# Altium project MK3 Watch Board.PrjPcb
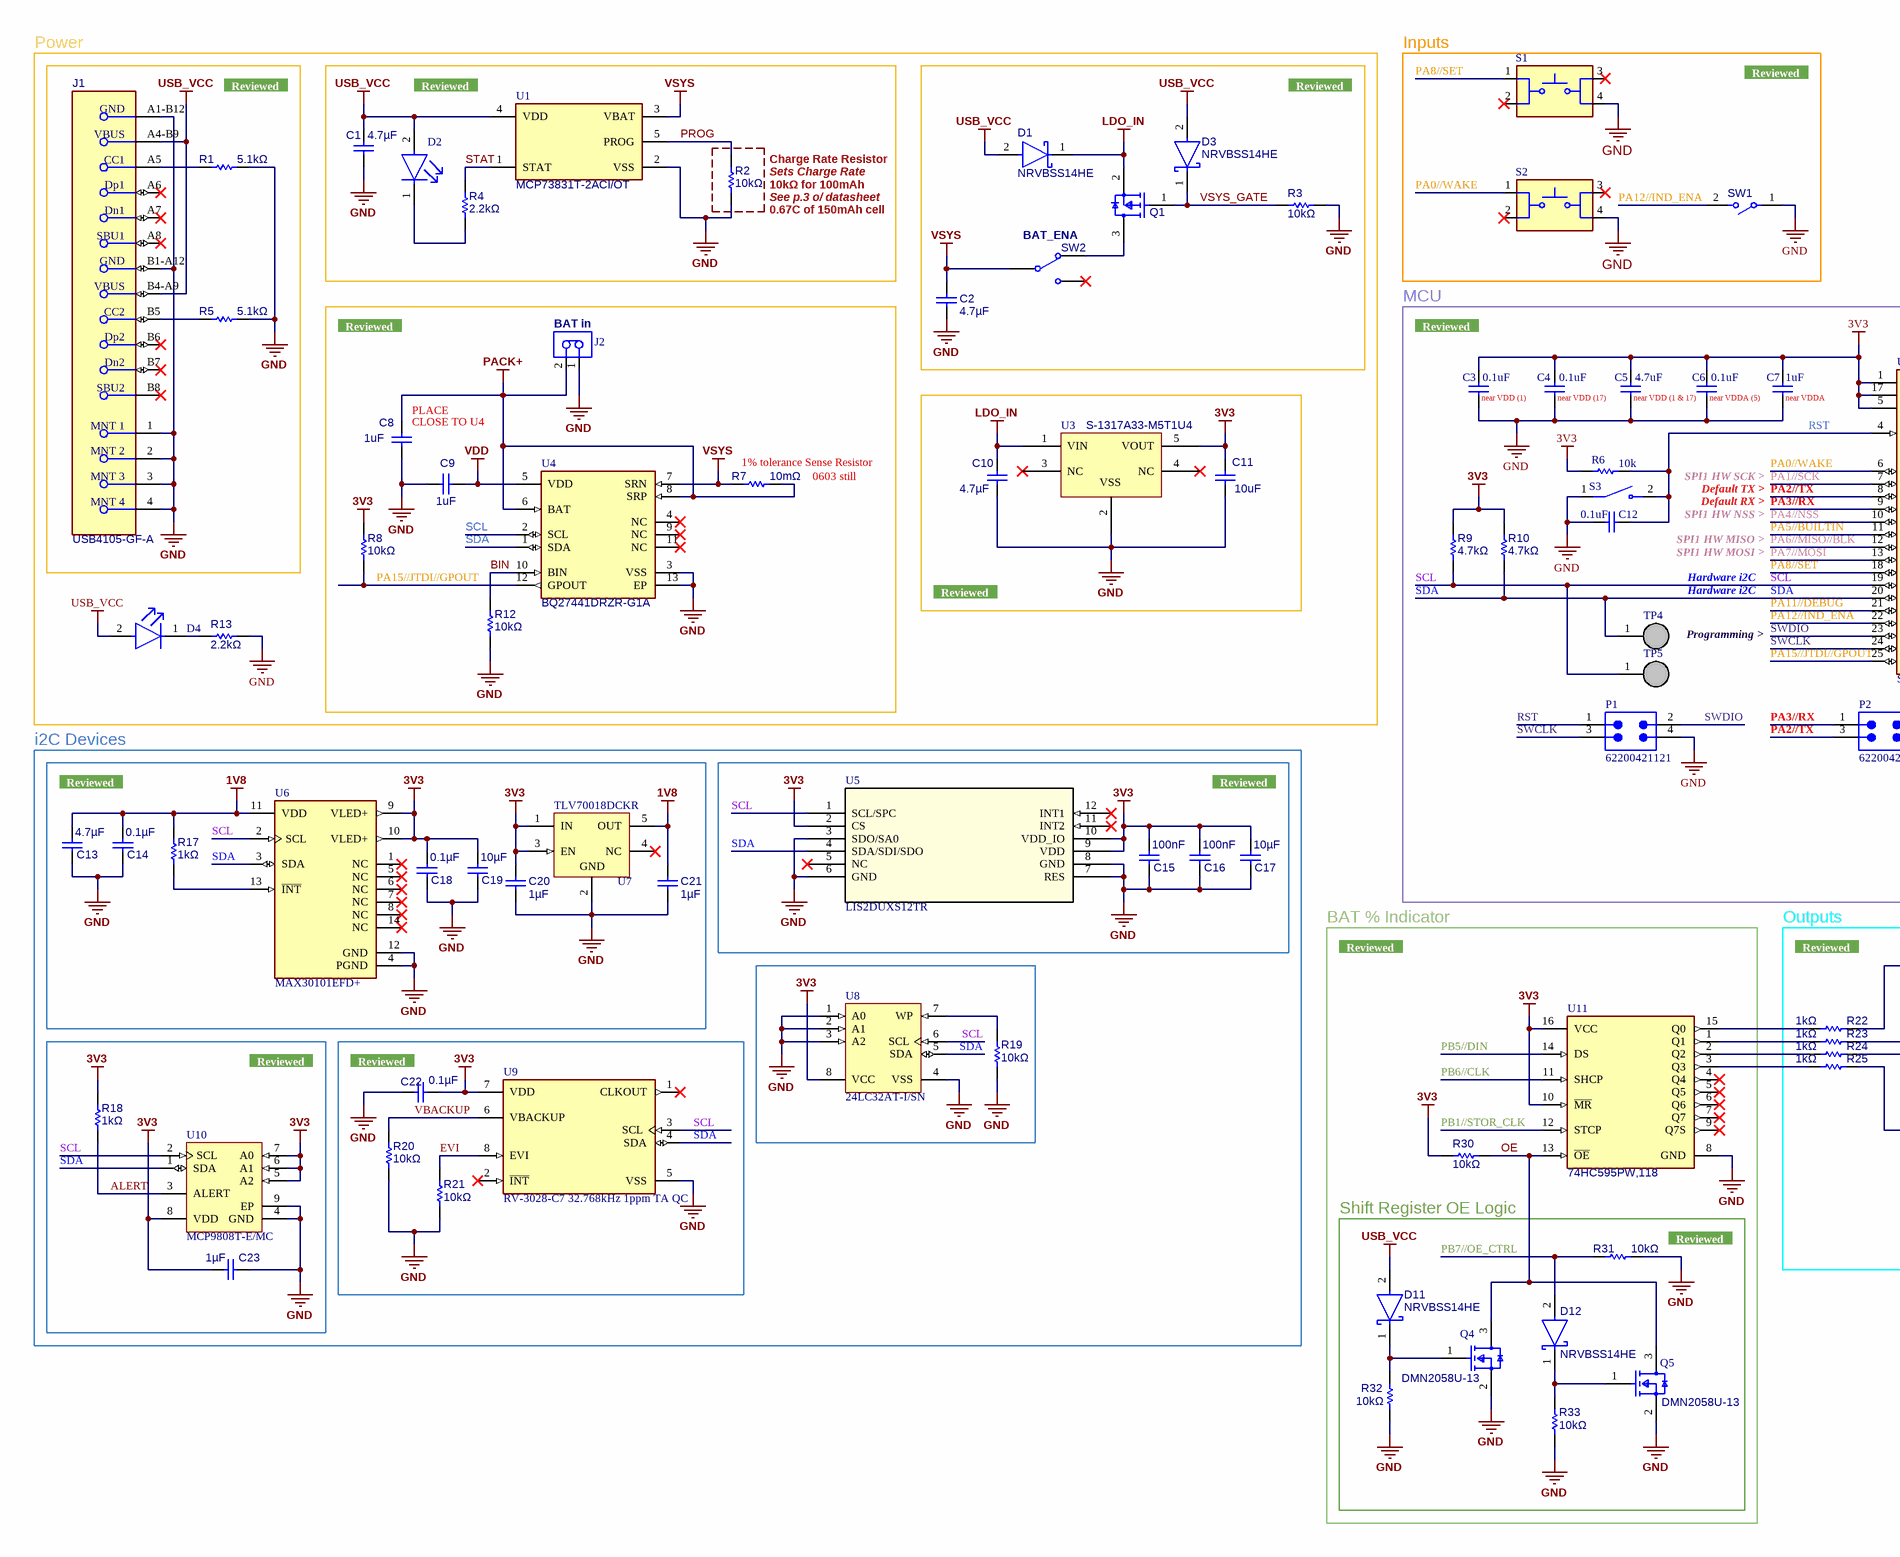
[diagram p0: Main.SchDoc, left]
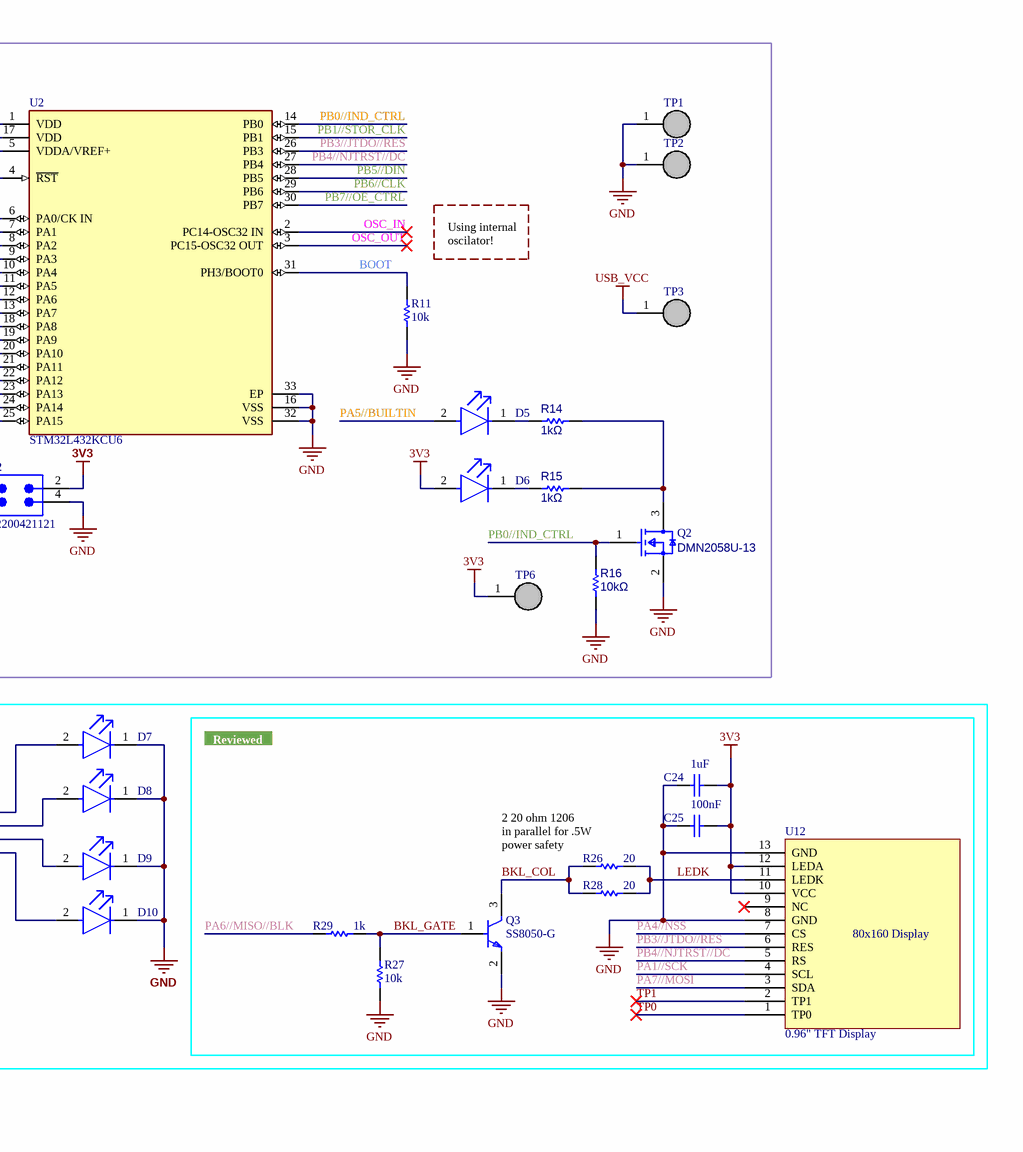
[diagram p1: Main.SchDoc, right]
1 sheet, 102 parts. Net scope: global (net labels, ports and power ports of the same name join across sheets).
Board file: Main.PcbDoc

## Sheet Main.SchDoc
size 1524 x 1524 mm; SheetNumber: 1; SheetTotal: 1

### Parts
C1  4.7µF  [WCAP-CSGP_0603_L1.6W0.8H0.8_Reflow]
C2  4.7µF  [WCAP-CSGP_0603_L1.6W0.8H0.8_Reflow]
C3  0.1uF  [CAPC1608X87X35NL15T15]
C4  0.1uF  [CAPC1608X87X35NL15T15]
C5  4.7uF  [CAPC1608X87X35NL15T15]
C6  0.1uF  [CAPC1608X87X35NL15T15]
C7  1uF  [CAPC1608X87X35NL15T15]
C8  1uF  [WCAP-CSGP_0603_L1.6W0.8H0.8_Reflow]
C9  1uF  [WCAP-CSGP_0603_L1.6W0.8H0.8_Reflow]
C10  4.7µF  [WCAP-CSGP_0603_L1.6W0.8H0.8_Reflow]
C11  10uF  [WCAP-CSGP_0603_L1.6W0.8H0.8_Reflow]
C12  0.1uF  [CAPC1608X87X35NL15T15]
C13  4.7µF  [WCAP-CSGP_0603_L1.6W0.8H0.8_Reflow]
C14  0.1µF  [WCAP-CSGP_0603_L1.6W0.8H0.8_Reflow]
C15  100nF  [WCAP-CSGP_0603_L1.6W0.8H0.8_Reflow]
C16  100nF  [WCAP-CSGP_0603_L1.6W0.8H0.8_Reflow]
C17  10µF  [WCAP-CSGP_0603_L1.6W0.8H0.8_Reflow]
C18  0.1µF  [WCAP-CSGP_0603_L1.6W0.8H0.8_Reflow]
C19  10µF  [WCAP-CSGP_0603_L1.6W0.8H0.8_Reflow]
C20  1µF  [WCAP-CSGP_0603_L1.6W0.8H0.8_Reflow]
C21  1µF  [WCAP-CSGP_0603_L1.6W0.8H0.8_Reflow]
C22  0.1µF  [WCAP-CSGP_0603_L1.6W0.8H0.8_Reflow]
C23  1µF  [WCAP-CSGP_0603_L1.6W0.8H0.8_Reflow]
C24  1uF  [CAPC1608X87X35NL15T15]
C25  100nF  [CAPC1608X87X35NL15T15]
D1  NRVBSS14HE  [FP-477AD-MFG]
D2  LTST-C190KGKT  [FP-LTST-C190KGKT-MFG]  (value not drawn)
D3  NRVBSS14HE  [FP-477AD-MFG]
D4  LTST-C190KGKT  [FP-LTST-C190KGKT-MFG]  (value not drawn)
D5  LTST-C190KGKT  [FP-LTST-C190KGKT-MFG]  (value not drawn)
D6  LTST-C190KGKT  [FP-LTST-C190KGKT-MFG]  (value not drawn)
D7  LTST-C190KGKT  [FP-LTST-C190KGKT-MFG]  (value not drawn)
D8  LTST-C190KGKT  [FP-LTST-C190KGKT-MFG]  (value not drawn)
D9  LTST-C190KGKT  [FP-LTST-C190KGKT-MFG]  (value not drawn)
D10  LTST-C190KGKT  [FP-LTST-C190KGKT-MFG]  (value not drawn)
D11  NRVBSS14HE  [FP-477AD-MFG]
D12  NRVBSS14HE  [FP-477AD-MFG]
J1  USB4105-GF-A  [FP-USB4105-GF-A-MFG]
J2  B2B-PH-K-S(LF)(SN)  [JST-B2B-PH-K-S_V]  (value not drawn)
P1  62200421121  [62200421121]
P2  62200421121  [62200421121]
Q1  IRLML6402TRPBF  [FP-Micro3-MFG]  (value not drawn)
Q2  DMN2058U-13  [FP-C04-17458-MFG]
Q3  SS8050-G  [FP-SS8050-G-MFG]
Q4  DMN2058U-13  [FP-C04-17458-MFG]
Q5  DMN2058U-13  [FP-C04-17458-MFG]
R1  5.1kΩ  [RESC1608X55X25NL10T15]
R2  10kΩ  [RESC1608X55X25NL10T15]
R3  10kΩ  [RESC1608X55X25NL10T15]
R4  2.2kΩ  [RESC1608X55X25NL10T15]
R5  5.1kΩ  [RESC1608X55X25NL10T15]
R6  10k  [RESC1608X55X25NL10T15]
R7  10mΩ  [RESC1608X55X25NL10T15]
R8  10kΩ  [RESC1608X55X25NL10T15]
R9  4.7kΩ  [RESC1608X55X25NL10T15]
R10  4.7kΩ  [RESC1608X55X25NL10T15]
R11  10k  [RESC1608X55X25NL10T15]
R12  10kΩ  [RESC1608X55X25NL10T15]
R13  2.2kΩ  [RESC1608X55X25NL10T15]
R14  1kΩ  [RESC1608X55X25NL10T15]
R15  1kΩ  [RESC1608X55X25NL10T15]
R16  10kΩ  [RESC1608X55X25NL10T15]
R17  1kΩ  [RESC1608X55X25NL10T15]
R18  1kΩ  [RESC1608X55X25NL10T15]
R19  10kΩ  [RESC1608X55X25NL10T15]
R20  10kΩ  [RESC1608X55X25NL10T15]
R21  10kΩ  [RESC1608X55X25NL10T15]
R22  1kΩ  [RESC1608X55X25NL10T15]
R23  1kΩ  [RESC1608X55X25NL10T15]
R24  1kΩ  [RESC1608X55X25NL10T15]
R25  1kΩ  [RESC1608X55X25NL10T15]
R26  20  [RESC3116X65X40NL10T20]
R27  10k  [RESC1608X55X25NL10T15]
R28  20  [RESC3116X65X40NL10T20]
R29  1k  [RESC1608X55X25NL10T15]
R30  10kΩ  [RESC1608X55X25NL10T15]
R31  10kΩ  [RESC1608X55X25NL10T15]
R32  10kΩ  [RESC1608X55X25NL10T15]
R33  10kΩ  [RESC1608X55X25NL10T15]
S1  SWT0325-073016TSK_REVA  [SW_SWT0325-073016TSK_REVA]  (value not drawn)
S2  SWT0325-073016TSK_REVA  [SW_SWT0325-073016TSK_REVA]  (value not drawn)
S3  TS09-63-25-WT-260-SMT-TR  [SW_TS09-63-25-WT-260-SMT-TR]  (value not drawn)
SW1  B3U-1000P-B  [FP-B3U-1000P-B-MFG]  (value not drawn)
SW2  450404015514  [450404015514]  (value not drawn)
TP1  Testpoint  [Testpoint Footprint]  (value not drawn)
TP2  Testpoint  [Testpoint Footprint]  (value not drawn)
TP3  Testpoint  [Testpoint Footprint]  (value not drawn)
TP4  Testpoint  [Testpoint Footprint]  (value not drawn)
TP5  Testpoint  [Testpoint Footprint]  (value not drawn)
TP6  Testpoint  [Testpoint Footprint]  (value not drawn)
U1  MCP73831T-2ACI/OT  [FP-C04-091-OT-MFG]
U2  STM32L432KCU6  [FP-UFQFPN32-A0B8-MFG]
U3  S-1317A33-M5T1U4  [S-1317A33-M5T1U4]
U4  BQ27441DRZR-G1A  [FP-DRZ0012A-MFG]
U5  LIS2DUXS12TR  [QFN_DUXS12_STM]
U6  MAX30101EFD+  [FP-F143A5-1-MFG]
U7  TLV70018DCKR  [DCK0005A_L]
U8  24LC32AT-I/SN  [SOIC-SN8_L]
U9  RV-3028-C7 32.768kHz 1ppm TA QC  [FP-RV-3028-C7_32_768kHz_1-MFG]
U10  MCP9808T-E/MC  [MCHP-DFN-MC8_V]
U11  74HC595PW,118  [FP-SOT403-1-MFG]
U12  0.96" TFT Display  [PCBComponent_1]

### Blocks framed on the sheet
Power: C1 C8-C11 D2 D4 J1 J2 R1 R2 R4 R5 R7 R8 R12 R13 U1 U3 U4
BAT_ENA: C2 D1 D3 Q1 R3 SW2
Inputs: S1 S2 SW1
MCU: C3-C7 C12 D5 D6 P1 P2 Q2 R6 R9-R11 R14-R16 S3 TP1-TP6 U2
i2C Devices: C13-C23 R17-R21 U5-U10
BAT % Indicator: R30 U11
Outputs: C24 C25 D7-D10 Q3 R22-R29 U12
Shift Register OE Logic: D11 D12 Q4 Q5 R31-R33

### Nets
1V8: C13.1 C14.1 C21.2 R17.2 U6.11(VDD) U7.5(OUT)
3V3: C3.1 C4.1 C5.1 C6.1 C7.1 C11.2 C15.1 C16.1 C17.1 C18.1 C19.1 C20.2 C22.1 C23.1 C24.1 C25.1 D6.2(A) P2.2 R6.2 R8.2 R9.1 R10.1 R18.2 R30.1 TP6.1 U2.1(VDD) U2.5(VDDA/VREF+) U2.17(VDD) U3.5(VOUT) U5.2(CS) U5.9(VDD) U5.10(VDD_IO) U6.9(VLED+) U6.10(VLED+) U7.1(IN) U7.3(EN) U8.8(VCC) U9.7(VDD) U10.5(A2) U10.6(A1) U10.7(A0) U10.8(VDD) U11.10(~{MR}) U11.16(VCC) U12.10(VCC) U12.12(LEDA)
GND: C1.1 C2.1 C3.2 C4.2 C5.2 C6.2 C7.2 C8.2 C9.2 C10.1 C11.1 C12.1 C13.2 C14.2 C15.2 C16.2 C17.2 C18.2 C19.2 C20.1 C21.1 C22.2 C23.2 C24.2 C25.2 D7.1(C) D8.1(C) D9.1(C) D10.1(C) J1.1(MNT_1) J1.2(MNT_2) J1.3(MNT_3) J1.4(MNT_4) J1.A1-B12(GND) J1.B1-A12(GND) J2.1 P1.4 P2.4 Q2.2(S) Q3.2(E) Q4.2(S) Q5.2(S) R1.1 R2.2 R3.2 R5.1 R11.1 R12.1 R13.1 R16.1 R19.1 R20.1 R21.1 R27.1 R31.2 R32.1 R33.1 S1.4 S2.4 S3.1 SW1.1 TP1.1 TP2.1 U1.2(VSS) U2.16(VSS) U2.32(VSS) U2.33(EP) U3.2(VSS) U4.3(VSS) U4.13(EP) U5.3(SDO/SA0) U5.6(GND) U5.7(RES) U5.8(GND) U6.4(PGND) U6.12(GND) U7.2(GND) U8.1(A0) U8.2(A1) U8.3(A2) U8.4(VSS) U9.5(VSS) U10.4(GND) U10.9(EP) U11.8(GND) U12.8(GND) U12.13(GND)
LDO_IN: C10.2 D1.1(C) Q1.2(S) U3.1(VIN)
PACK+: C8.1 J2.2 R7.2 U4.6(BAT) U4.8(SRP)
USB_VCC: C1.2 D1.2(A) D2.2(A) D3.2(A) D4.2(A) D11.2(A) J1.A4-B9(VBUS) J1.B4-A9(VBUS) TP3.1 U1.4(VDD)
VDD: C9.1 U4.5(VDD)
VSYS: C2.2 R7.1 SW2.COM U1.3(VBAT) U4.7(SRN)
ALERT: R18.1 U10.3(ALERT)
BIN: R12.2 U4.10(BIN)
BKL_COL: Q3.3(C) R26.1 R28.1
BKL_GATE: Q3.1(B) R27.2 R29.2
BOOT: R11.2 U2.31(PH3/BOOT0)
EVI: R21.2 U9.8(EVI)
LEDK: R26.2 R28.2 U12.11(LEDK)
OE: Q4.3(D) Q5.3(D) R30.2 U11.13(~{OE})
OSC_IN: U2.2(PC14-OSC32_IN)
OSC_OUT: U2.3(PC15-OSC32_OUT)
PA0//WAKE: S2.1 U2.6(PA0/CK_IN)
PA1//SCK: U2.7(PA1) U12.4(SCL)
PA2//TX: P2.3 U2.8(PA2)
PA3//RX: P2.1 U2.9(PA3)
PA4//NSS: U2.10(PA4) U12.7(CS)
PA5//BUILTIN: D5.2(A) U2.11(PA5)
PA6//MISO//BLK: R29.1 U2.12(PA6)
PA7//MOSI: U2.13(PA7) U12.3(SDA)
PA8//SET: S1.1 U2.18(PA8)
PA11//DEBUG: U2.21(PA11)
PA12//IND_ENA: SW1.2 U2.22(PA12)
PA15//JTDI//GPOUT: R8.1 U2.25(PA15) U4.12(GPOUT)
PB0//IND_CTRL: Q2.1(G) R16.2 U2.14(PB0)
PB1//STOR_CLK: U2.15(PB1) U11.12(STCP)
PB3//JTDO//RES: U2.26(PB3) U12.6(RES)
PB4//NJTRST//DC: U2.27(PB4) U12.5(RS)
PB5//DIN: U2.28(PB5) U11.14(DS)
PB6//CLK: U2.29(PB6) U11.11(SHCP)
PB7//OE_CTRL: D12.2(A) R31.1 U2.30(PB7)
PROG: R2.1 U1.5(PROG)
RST: C12.2 P1.1 R6.1 S3.2 U2.4(~{RST})
SCL: R9.2 TP5.1 U2.19(PA9) U4.2(SCL) U5.1(SCL/SPC) U6.2(SCL) U8.6(SCL) U9.3(SCL) U10.2(SCL)
SDA: R10.2 TP4.1 U2.20(PA10) U4.1(SDA) U5.4(SDA/SDI/SDO) U6.3(SDA) U8.5(SDA) U9.4(SDA) U10.1(SDA)
STAT: R4.2 U1.1(STAT)
SWCLK: P1.3 U2.24(PA14)
SWDIO: P1.2 U2.23(PA13)
TP0: U12.1(TP0)
TP1: U12.2(TP1)
VBACKUP: R20.2 U9.6(VBACKUP)
VSYS_GATE: D3.1(C) Q1.1(G) R3.1
NetD2_1: D2.1(C) R4.1
NetD4_1: D4.1(C) R13.2
NetD5_1: D5.1(C) R14.2
NetD6_1: D6.1(C) R15.2
NetD7_2: D7.2(A) R22.1
NetD8_2: D8.2(A) R23.1
NetD9_2: D9.2(A) R24.1
NetD10_2: D10.2(A) R25.1
NetD11_1: D11.1(C) Q4.1(G) R32.2
NetD12_1: D12.1(C) Q5.1(G) R33.2
NetJ1_A5: J1.A5(CC1) R1.2
NetJ1_B5: J1.B5(CC2) R5.2
NetQ1_3: Q1.3(D) SW2.L1
NetQ2_3: Q2.3(D) R14.1 R15.1
NetR17_1: R17.1 U6.13(~{INT})
NetR19_2: R19.2 U8.7(WP)
NetR22_2: R22.2 U11.15(Q0)
NetR23_2: R23.2 U11.1(Q1)
NetR24_2: R24.2 U11.2(Q2)
NetR25_2: R25.2 U11.3(Q3)

Not connected (* = marked no-connect by the designer): J1 A6(Dp1)* A7(Dn1)* A8(SBU1)* B6(Dp2)* B7(Dn2)* B8(SBU2)*; S1 2* 3*; S2 2* 3*; SW2 L2*; U3 3(NC)* 4(NC)*; U4 4(NC)* 9(NC)* 11(NC)*; U5 5(NC)* 11(INT2)* 12(INT1)*; U6 1(NC)* 5(NC)* 6(NC)* 7(NC)* 8(NC)* 14(NC)*; U7 4(NC)*; U9 1(CLKOUT)* 2(~{INT})*; U11 4(Q4)* 5(Q5)* 6(Q6)* 7(Q7)* 9(Q7S)*; U12 9(NC)*

### Notes on the sheet
- Reviewed
- (near R2) Charge Rate Resistor
- (near R2) Sets Charge Rate
- (near R2) 10kΩ for 100mAh
- (near R2) See p.3 o/ datasheet
- (near R2) 0.67C of 150mAh cell
- (near J2) BAT in
- (near C3) near VDD (1)
- (near C4) near VDD (17)
- near VDD (1 & 17)
- (near C6) near VDDA (5)
- (near C7) near VDDA
- (near C8) CLOSE TO U4
- (near C8) PLACE
- (near R7) 1% tolerance Sense Resistor
- (near R7) 0603 still
- Default TX >
- Default RX >
- SPI1 HW SCK >
- SPI1 HW NSS >
- Using internal oscilator!
- Hardware i2C
- SPI1 HW MISO >
- SPI1 HW MOSI >
- Programming >
- (near C22) Reviewed
- (near R26) 2 20 ohm 1206
- (near R26) in parallel for .5W
- (near R26) power safety
- (near R31) Reviewed
- (in symbol 0.96" TFT Display) 80x160 Display

### Library data of the parts
C1 C2 C8-C11 = CMP-207839-000060-3
C3-C7 C12 C24 C25 = CMP-2006-03301-1
C13-C23 = CMP-207839-000060-3: 10V tolerance
D1 D3 D11 D12 = CMP-00278-93203856-2: NRVBSS14HE Rectifier Diode, Schottky, 1 Phase, 1 Element, 1A, 40V V(RRM), Silicon; Manufacturer Lifecycle Status: ACTIVE; Capacitance: 55pF; Max Forward Surge Current (Ifsm): 25A; Peak Reverse Current: 5µA; Max Junction Temperature (Tj): 150°C; Forward Current: 1A; Min Operating Temperature: -55°C; NexarPartId: 93203856; Reverse Voltage: 40V; Max Operating Temperature: 150°C; RoHS: Compliant; Lifecycle Status: Production; Max Repetitive Reverse Voltage (Vrrm): 40V; Height: 750µm
D2 D4-D10 = CMP-2000-05197-2: LED GREEN CLEAR CHIP SMD; Test Current: 20mA; Power Rating: 75mW; Forward Voltage: 2V; Wavelength: 574nm; Number of LEDs: 1; Reverse Voltage: 5V; Dominant Wavelength: 571nm; Lens Style: Diffused; Luminous Intensity: 35mcd; Forward Current: 30mA; Viewing Angle: 130°; Lens Color: Colorless; Width: 0.8mm; Case Code (Imperial): 0603; Case Code (Metric): 1608; Number of Pins: 2; Radiation Hardening: No; Package Quantity: 1; Lead Free: Lead Free; Lens Transparency: Clear; Depth: 0.8mm; Power Dissipation: 75mW; Mount: Surface Mount; Max Operating Temperature: 85°C; Case/Package: 0603; Height: 0.8mm; Illumination Color: Green; Color: Green; Length: 1.6mm; Packaging: Tape and Reel; Number of Elements: 1; Min Operating Temperature: -55°C
J1 = CMP-245163-000001-1: CONN RCPT USB2.0 TYPEC 5A; Manufacturer: GCT; Voltage Rating: 20V; Is Female: yes; Current Rating: 5/6.25/1.25/0.25A; Number Of Contacts: 16; Conn Orientation: Right Angle; Device Class L1: Connectors; Category: Conn; Lead Free: Yes; RoHS: TRUE; Temperature Range High: +85°C; Digikey Description: CONN RCPT USB2.0 TYPEC 5A; Device Class L3: unset; ComponentLink2Description: Datasheet; Manufacturer Part Number: USB4105-GF-A; Package: 0; Usb Standard: USB 2.0; Device Class L2: USB Connectors; Automotive: No; Temperature Range Low: -40°C; Height: 3.46mm; Temperature: -40°C to +85°C; Contact Material: Gold,Nickel; ComponentLink2URL: https://gct.co/files/drawings/usb4105.pdf; Octopart: https://octopart.com/usb4105-gf-a-gct-106627878
J2 = CMP-2000-05162-1: Male Header, Pitch 2 mm, 1 x 2 Position, Height 6 mm, Tail Length 3.4 mm, -25 to 85 degC, RoHS, Bulk; Manufacturer: JST; Pitch: 2mm; Style/Orientation: StraightHeader/Plug; No of Positions: 2; Datasheet Version: Nov-08; Datasheet URL: http://datasheet.octopart.com/B2B-PH-K-S%28LF%29%28SN%29-JST-datasheet-8324864.pdf; Manufacturer URL: http://www.jst.com/home2.html; Type: ShroudedHeader; Termination: Crimp
P1 P2 = CMP-1502-00946-4: THT Vertical Pin Header WR-PHD, Pitch 1.27 mm, Dual Row, 4 pins; Row Spacing: 1.27mm; Gender: Male; Number of Positions: 4; Contact Resistance: 20mΩ; Current Rating: 1A; Operating Supply Voltage: 100V; Connector Type: Male Pin; Pitch: 1.27mm; Termination: Solder; Packaging: Box; Contact Mating Length: 3.81mm; Number of Pins: 4; Color: Black; Number of Contacts: 4; Contact Material: Copper; Orientation: Vertical; RoHS: Compliant; Mount: Through Hole; Lead Pitch: 1.27mm; Contact Plating: Gold; Number of Rows: 2
Q1 = CMP-32901-000130-1: MOSFET P-CH 20V 3.7A SOT-23; Manufacturer: Infineon; Reverse Recovery Time: 29ns; Max Forward Diode Voltage: -1.2V; Input Capacitace At Vds: 633pF @ -10V; Drain To Source Resistance: 0.05Ω; Gate To Source Voltage: 12V; Max Junction Temp: +150°C; Pulse Drain Current: -22A; Threshold Vgs Min: -0.4V; Turn Off Delay Time: 588ns; Number Of Channels: 1; Power Dissipation: 1.3W; Turn On Delay Time: 350ns; Drain To Source Breakdown Voltage: -20V; Continuous Drain Current: -3.7A; Depletion Mode: False; Gate Charge At Vgs: 8nC @ -5V; Rthja Max: 75°C/W; Threshold Vgs: -0.55V; Standoff Height: 0.01mm; Reverse Recovery Charge: 11nC; Device Class L2: Transistors; Ipc Land Pattern Name: SOT95P237X100-3; Temperature Range High: +150°C; Octopart: https://octopart.com/irlml6402trpbf-infineon-65874989; ComponentLink2URL: https://www.infineon.com/dgdl/irlml6402pbf.pdf?fileId=5546d462533600a401535668d5c2263c; Automotive: No; Manufacturer Part Number: IRLML6402TRPBF; Height: 1.12mm; Drain To Source Voltage: -20V; Digikey Description: MOSFET P-CH 20V 3.7A SOT-23; Device Class L1: Discrete Semiconductors; Package: Micro3; Lead Free: Yes; Temperature Range Low: -55°C; Number Of P Channels: 1; Technology: MOSFET; Temperature: -55°C to +150°C; Category: Trans; Footprint Url: http://irf.com/package/outline/po_micro3.pdf; RoHS: TRUE; Device Class L3: MOSFETs; Threshold Vgs Max: -1.2V; ComponentLink2Description: Datasheet
Q2 Q4 Q5 = CMP-00252-47153607-1: TN2130K1-G Mosfet, N-Channel Enhancement-Mode, 300V, 25 Ohm Rohs Compliant: Yes; Gate to Source Voltage (Vgs): 20V; Drain to Source Resistance: 25Ω; Element Configuration: Single; Number of Channels: 1; Fall Time: 7ns; Turn-On Delay Time: 10ns; Turn-Off Delay Time: 12ns; Input Capacitance: 50pF; Power Dissipation: 360mW; Continuous Drain Current (ID): 85mA; Weight: 1.437803g; Rds On Max: 25Ω; Case/Package: SOT-23; Min Operating Temperature: -55°C; Length: 2.9mm; RoHS: Compliant; Lifecycle Status: Production; Height: 950µm; Drain to Source Voltage (Vdss): 300V; NexarPartId: 47153607; Rise Time: 7ns; Lead Free: Lead Free; Width: 1.3mm; Mount: Surface Mount; Number of Pins: 3; Drain to Source Breakdown Voltage: 300V; Radiation Hardening: No; Max Operating Temperature: 150°C; Number of Elements: 1; Max Power Dissipation: 360mW; Schedule B: 8541210080, 8541210080
Q3 = CMP-20235-000001-1: NPN TRANSISTOR 1.5A 40V SOT-23 R; Transition Frequency: 100MHz; Max Breakdown Voltage: 25V; Collector Emitter Voltage (VCEO): 400mV; Max Power Dissipation: 300mW; Max Collector Current: 1.5A; Case/Package: TO-236-3; Packaging: Tape and Reel; RoHS Compliant: Yes; Mount: Surface Mount; Collector Emitter Breakdown Voltage: 25V
R1-R5 R7-R10 R12-R25 R30-R33 = CMP-2000-04186-1
R6 R11 R27 R29 = CMP-2000-04525-1: Part Number: RT0603BRE071KL; Manufacturer: Yageo
R26 R28 = CMP-2003-03957-1: Manufacturer: Yageo; Part Number: RC1206JR-0720RL
S1 S2 = SWT0325-073016TSK_REVA: 6mm x 6mm Through Hole Tactile Switch; MF: Global Connector Technology; SnapEDA_Link: https://www.snapeda.com/parts/SWT0325-073016TSK/Global+Connector+Technology/view-part/?ref=snap; Package: None; Value: *; MP: SWT0325-073016TSK; Check_prices: https://www.snapeda.com/parts/SWT0325-073016TSK/Global+Connector+Technology/view-part/?ref=eda
S3 = TS09-63-25-WT-260-SMT-TR: 6.1 x 3.7 mm, 2.5 mm Actuator Height, 260 gf, White, Surface Mount, SPST, Tactile Switch; MF: Same Sky; SnapEDA_Link: https://www.snapeda.com/parts/TS09-63-25-WT-260-SMT-TR/Same+Sky/view-part/?ref=snap; Package: None; Value: *; MP: TS09-63-25-WT-260-SMT-TR; Check_prices: https://www.snapeda.com/parts/TS09-63-25-WT-260-SMT-TR/Same+Sky/view-part/?ref=eda
SW1 = CMP-08834-000005-1: SWITCH TACTILE SPST-NO 0.05A 12V; Manufacturer: Omron; Operating Force: 1.5N; Contact Current Rating: 50mA; Contact Resistance: 100mΩ; Electromechanical Life: 200000Cycles; Height: 1.75mm; Device Class L2: Switches; Temperature Range High: +70°C; Digikey Description: SWITCH TACTILE SPST-NO 0.05A 12V; Throw Configuration: SPST-NO; Ambient Temperature Range High: +70°C; Temperature: -25°C to +70°C; Lead Free: Yes; ComponentLink2URL: https://omronfs.omron.com/en_US/ecb/products/pdf/en-b3u.pdf; Device Class L3: Tactile Switches; Manufacturer Part Number: B3U-1000P-B; Ambient Temperature Range Low: -25°C; Mount: Surface Mount; Automotive: No; Mouser Description: Tactile Switches Top Actuated with boss w/o ground; Octopart: https://octopart.com/b3u-1000p-b-omron-1057356; RoHS: TRUE; Package: 0; Device Class L1: Electromechanical; Voltage Rating Dc: 12V; Category: Switch; Temperature Range Low: -25°C; ComponentLink2Description: Datasheet
SW2 = CMP-03913-99472344-1: 450404015514 Slide Switch, 0.3A, 5Vdc, Smd Rohs Compliant: Yes; Current Rating: 300mA; Insulation Resistance: 100MΩ; Voltage Rating: 5V; NexarPartId: 99472344; Min Operating Temperature: -40°C; Contact Plating: Silver; Packaging: Tape and Reel; Max Operating Temperature: 85°C; RoHS: Compliant
U1 = CMP-0133-00143-2: IC CONTROLLR LI-ION 4.2V SOT23-5; Max Power Dissipation: 1.54W; Output Current: 500mA; Max Output Voltage: 4.5V; Number of Outputs: 1; Min Output Voltage: 4.168V; Min Supply Voltage: 3.75V; Max Input Voltage: 6V; Voltage Rating: 4.534V; Drain to Source Resistance: 350mR; Max Operating Temperature: 85°C; Length: 0.122inch; Number of Pins: 5; REACH SVHC: No SVHC; Radiation Hardening: No; Min Operating Temperature: -40°C; Weight: 0.00709oz; Contact Plating: Tin; Termination: SMD/SMT; Case/Package: SOT-23; Mount: Surface Mount; Width: 0.071inch; Packaging: Tape and Reel; Number of Cells: 1; Max Charge Current: 500mA; Height: 0.051inch; Number of Channels: 1; Output Voltage: 4.2V; Max Supply Voltage: 6V; Lead Free: Lead Free
U2 = CMP-12105-000033-1: IC MCU 32BIT 256KB FLASH 32QFPN; Manufacturer: STMicroelectronics; Max Supply Voltage: 3.6V; Number Of Timers/Counters: 11; Ram Size: 64KBytes; Number Of Usb Channels: 1; Memory Size: 256KBytes; Number Of Uart Channels: 3; Frequency: 80MHz; Number Of I2C Channels: 2; Core Architecture: ARM Cortex-M4; Number Of I/Os: 26; Min Supply Voltage: 1.62V; Data Bus Width: 32bits; Max Junction Temp: +105°C; Interface: I2C,SPI,UART,USART,CAN,USB,LIN,IrDA,Other; Ambient Temperature Range High: +85°C; Category: IC; Device Class L2: Embedded Processors and Controllers; Ambient Temperature Range Low: -40°C; Number Of Adc Channels: 11; ComponentLink2Description: Datasheet; Number Of A/D Converters: 1; Device Class L1: Integrated Circuits (ICs); Memory Type: FLASH; Height: 0.6mm; Temperature: -40°C to +105°C; Automotive: No; Temperature Range Low: -40°C; Digikey Description: IC MCU 32BIT 256KB FLASH 32QFPN; Manufacturer Part Number: STM32L432KCU6; Temperature Range High: +105°C; Octopart: https://octopart.com/stm32l432kcu6-stmicroelectronics-71093510; Device Class L3: Microcontrollers; Number Of Pwm Channels: 1; Number Of Spi Channels: 2; Lead Free: Yes; Number Of Cores: 1; Package: UFQFPN32-A0B8; ComponentLink2URL: https://www.st.com/content/ccc/resource/technical/document/datasheet/24/01/9f/59/f0/83/47/fc/DM00257205.pdf/files/DM00257205.pdf/jcr:content/translations/en.DM00257205.pdf; RoHS: TRUE
U4 = CMP-04911-000008-1: IC BATT FUEL GAUGE LI-ION 12SON; Manufacturer: Texas Instruments; Number Of Cells: 1; Nominal Supply Current: 93uA; Max Supply Voltage: 4.5V; Standoff Height: 0mm; Min Supply Voltage: 2.45V; Output Voltage: 1.8V; Temperature Range High: +85°C; Temperature: -40°C to +85°C; Device Class L2: Power Management ICs; Device Class L1: Integrated Circuits (ICs); Lead Free: Yes; Height: 1mm; Package: DRZ0012A; Number Of Outputs: 1; ComponentLink2URL: http://www.ti.com/lit/gpn/bq27441-g1; Ambient Temperature Range High: +85°C; Category: IC; Manufacturer Part Number: BQ27441DRZR-G1A; Device Class L3: Battery Management; RoHS: TRUE; Octopart: https://octopart.com/bq27441drzr-g1a-texas+instruments-30555829; Ambient Temperature Range Low: -40°C; Automotive: No; Mouser Description: System-Side Impedance Track? Battery Fuel (Gas) Gauge 12-SON -40 to 85; Digikey Description: IC BATT FUEL GAUGE LI-ION 12SON; Temperature Range Low: -40°C; ComponentLink2Description: Datasheet
U5 = LIS2DUXS12TR: Ultralow-power 3-axis smart accelerometer with Qvar, AI, antialiasing filter, and advanced digital features; Manufacturer_Name: STMicroelectronics; Type: Motion Sensors; Copyright: Copyright (C) 2025 Ultra Librarian. All rights reserved.; Manufacturer_Part_Number: LIS2DUXS12TR; RefDes: RefDes
U6 = CMP-05738-000001-1: INTEGRATED OPTICAL SENSOR; Manufacturer: Maxim Integrated; Max Supply Voltage: 2V; Max Junction Temp: +90°C; Operating Supply Current: 600uA; Min Supply Voltage: 1.7V; Sensor Output: I2C; RoHS: TRUE; Footprint Url: https://pdfserv.maximintegrated.com/land_patterns/90-0602.PDF; Manufacturer Part Number: MAX30101EFD+; Device Class L2: unset; Temperature Range Low: -40°C; Automotive: No; Height: 1.65mm; Temperature Range High: +85°C; ComponentLink2Description: Datasheet; Mouser Description: INTEGRATED OPTICAL SENSOR; ComponentLink2URL: https://datasheets.maximintegrated.com/en/ds/MAX30101.pdf; Octopart: https://octopart.com/max30101efd%2B-maxim+integrated-57054333; Temperature: -40°C to +85°C; Package: F143A5-1; Lead Free: Yes; Device Class L1: Sensors; Digikey Description: INTEGRATED OPTICAL SENSOR; Category: IC; Device Class L3: unset
U7 = CMP-0394-00928-2: Single Output LDO, 200 mA, Fixed 1.8 V Output, 2 to 5.5 V Input, with Low IQ, 5-pin SC70 (DCK), -40 to 125 degC, Green (RoHS & no Sb/Br); Manufacturer: Texas Instruments; Vout Adj(Max)(V): 1.8; Vin(Max)(V): 5.5; SubFamily: Single Channel LDO; Iout(Max)(A): 0.2; Iq(Typ)(mA): 0.03; Accuracy(%): 2; Vdo(Typ)(mV): 175; PartNumber: TLV70018DCKR; ComponentLink3URL: http://www.ti.com/litv/pdf/mpds025f; ComponentLink1URL: http://www.ti.com/; PackageDescription: 5-Pin Plastic Small-Outline, Body 2 x 1.25 mm, Pitch 0.65 mm; DatasheetVersion: SLVSA00D; Eco-Plan: Green (RoHS & no Sb/Br); Mounting Technology: Surface Mount; ComponentLink2URL: http://www.ti.com/general/docs/lit/getliterature.tsp?genericPartNumber=TLV70018&fileType=pdf; ComponentLink3Description: Package Specification; Vout Adj(Min)(V): 1.8; ComponentLink1Description: Manufacturer URL; Code_JEDEC: MO-203; PackageReference: DCK0005A; ComponentLink2Description: Datasheet; Vin(Min)(V): 2; PackageVersion: 4093553-3/G; Fixed Output Options(V): 1.8
U8 = CMP-0159-00227-1: 32Kbit, 400kHz, 2.5V, I2C Serial EEPROM, 8-Pin SOIC 150mil, Industrial Temperature, Tape and Reel; Code_IPC: SOIC127P600-8; PackageDescription: 8-Lead Plastic Small Outline (SN) - Narrow, 3.90mm Body [SOIC]; Code_JEDEC: MS-012; DatasheetVersion: revJ, Feb-2009; PackageVersion: revBB, Aug-2009; PackageReference: SOIC-SN8
U9 = CMP-226158-000001-1: Real Time Clock Serial 2byte Clock/Calendar/Alarm/Timer/Battery Backup 8-Pin CSMD T/R; Manufacturer: Micro Crystal; Memory Size: 2Bytes; Number Of Outputs: 1; Nominal Supply Current: 0.04uA; Interface: I2C; Max Supply Voltage: 5.5V; Min Supply Voltage: 1.1V; Package: RV-3028-C7 32.768kHz 1ppm TA QC; Lead Free: Yes; RoHS: TRUE; Device Class L1: Integrated Circuits (ICs); Temperature: -40°C to +85°C; ComponentLink2Description: Datasheet; Height: 0.8mm; Octopart: https://octopart.com/rv-3028-c7+32.768khz+1ppm+ta+qc-micro+crystal-98880451; ComponentLink2URL: https://www.microcrystal.com/fileadmin/Media/Products/RTC/Datasheet/RV-3028-C7.pdf; Device Class L2: Clock and Timing; Temperature Range Low: -40°C; Temperature Range High: +85°C; Automotive: No; Device Class L3: Real Time Clocks; Manufacturer Part Number: RV-3028-C7 32.768kHz 1ppm TA QC; Frequency: 32.768kHz; Ambient Temperature Range High: +85°C; Ambient Temperature Range Low: -40°C; Category: IC; Mouser Description: RV-3028-C7 32.768KHZ 1PPM Ta Qc
U10 = CMP-0192-00342-1: + / - 0.5 degC Maximum Accuracy Digital Temperature Sensor, 400 uA, 2.7 to 5.5 V, -40 to 125 degC, 8-pin DFN (MC8), Tape and Reel; Manufacturer: Microchip; DatasheetVersion: Rev. A; PartNumber: MCP9808T-E/MC; Mounting Technology: Surface Mount; ComponentLink4Description: Product URL; ComponentLink2URL: http://ww1.microchip.com/downloads/en/DeviceDoc/25095A.pdf; ComponentLink4URL: http://www.microchip.com/MCP9808; ComponentLink1Description: Manufacturer URL; ComponentLink3URL: http://www.microchip.com/stellent/groups/techpub_sg/documents/packagingspec/en012702.pdf; PackageDescription: 8-Lead Plastic Dual Flat, 2 x 3 mm Body, 0.5 mm Pitch; PackageVersion: C04-123C; PackageReference: DFN-MC8; ComponentLink2Description: Datasheet; ComponentLink1URL: http://www.microchip.com; ComponentLink3Description: Package Specification
U11 = CMP-14351-000004-1: IC SHIFT REGISTER 8BIT 16TSSOP